# Altium schematic sheet TSevenSegmentDisplay.SchDoc: LiveDesign Evaluation - EvalBoard Tester
size A3; Organization: Altium Limited; Address1: L3, 12a Rodborough Rd; Address2: Frenchs Forest; Address3: NSW; Address4: Australia 2086; DocumentNumber: 14; SheetNumber: 14; SheetTotal: 16
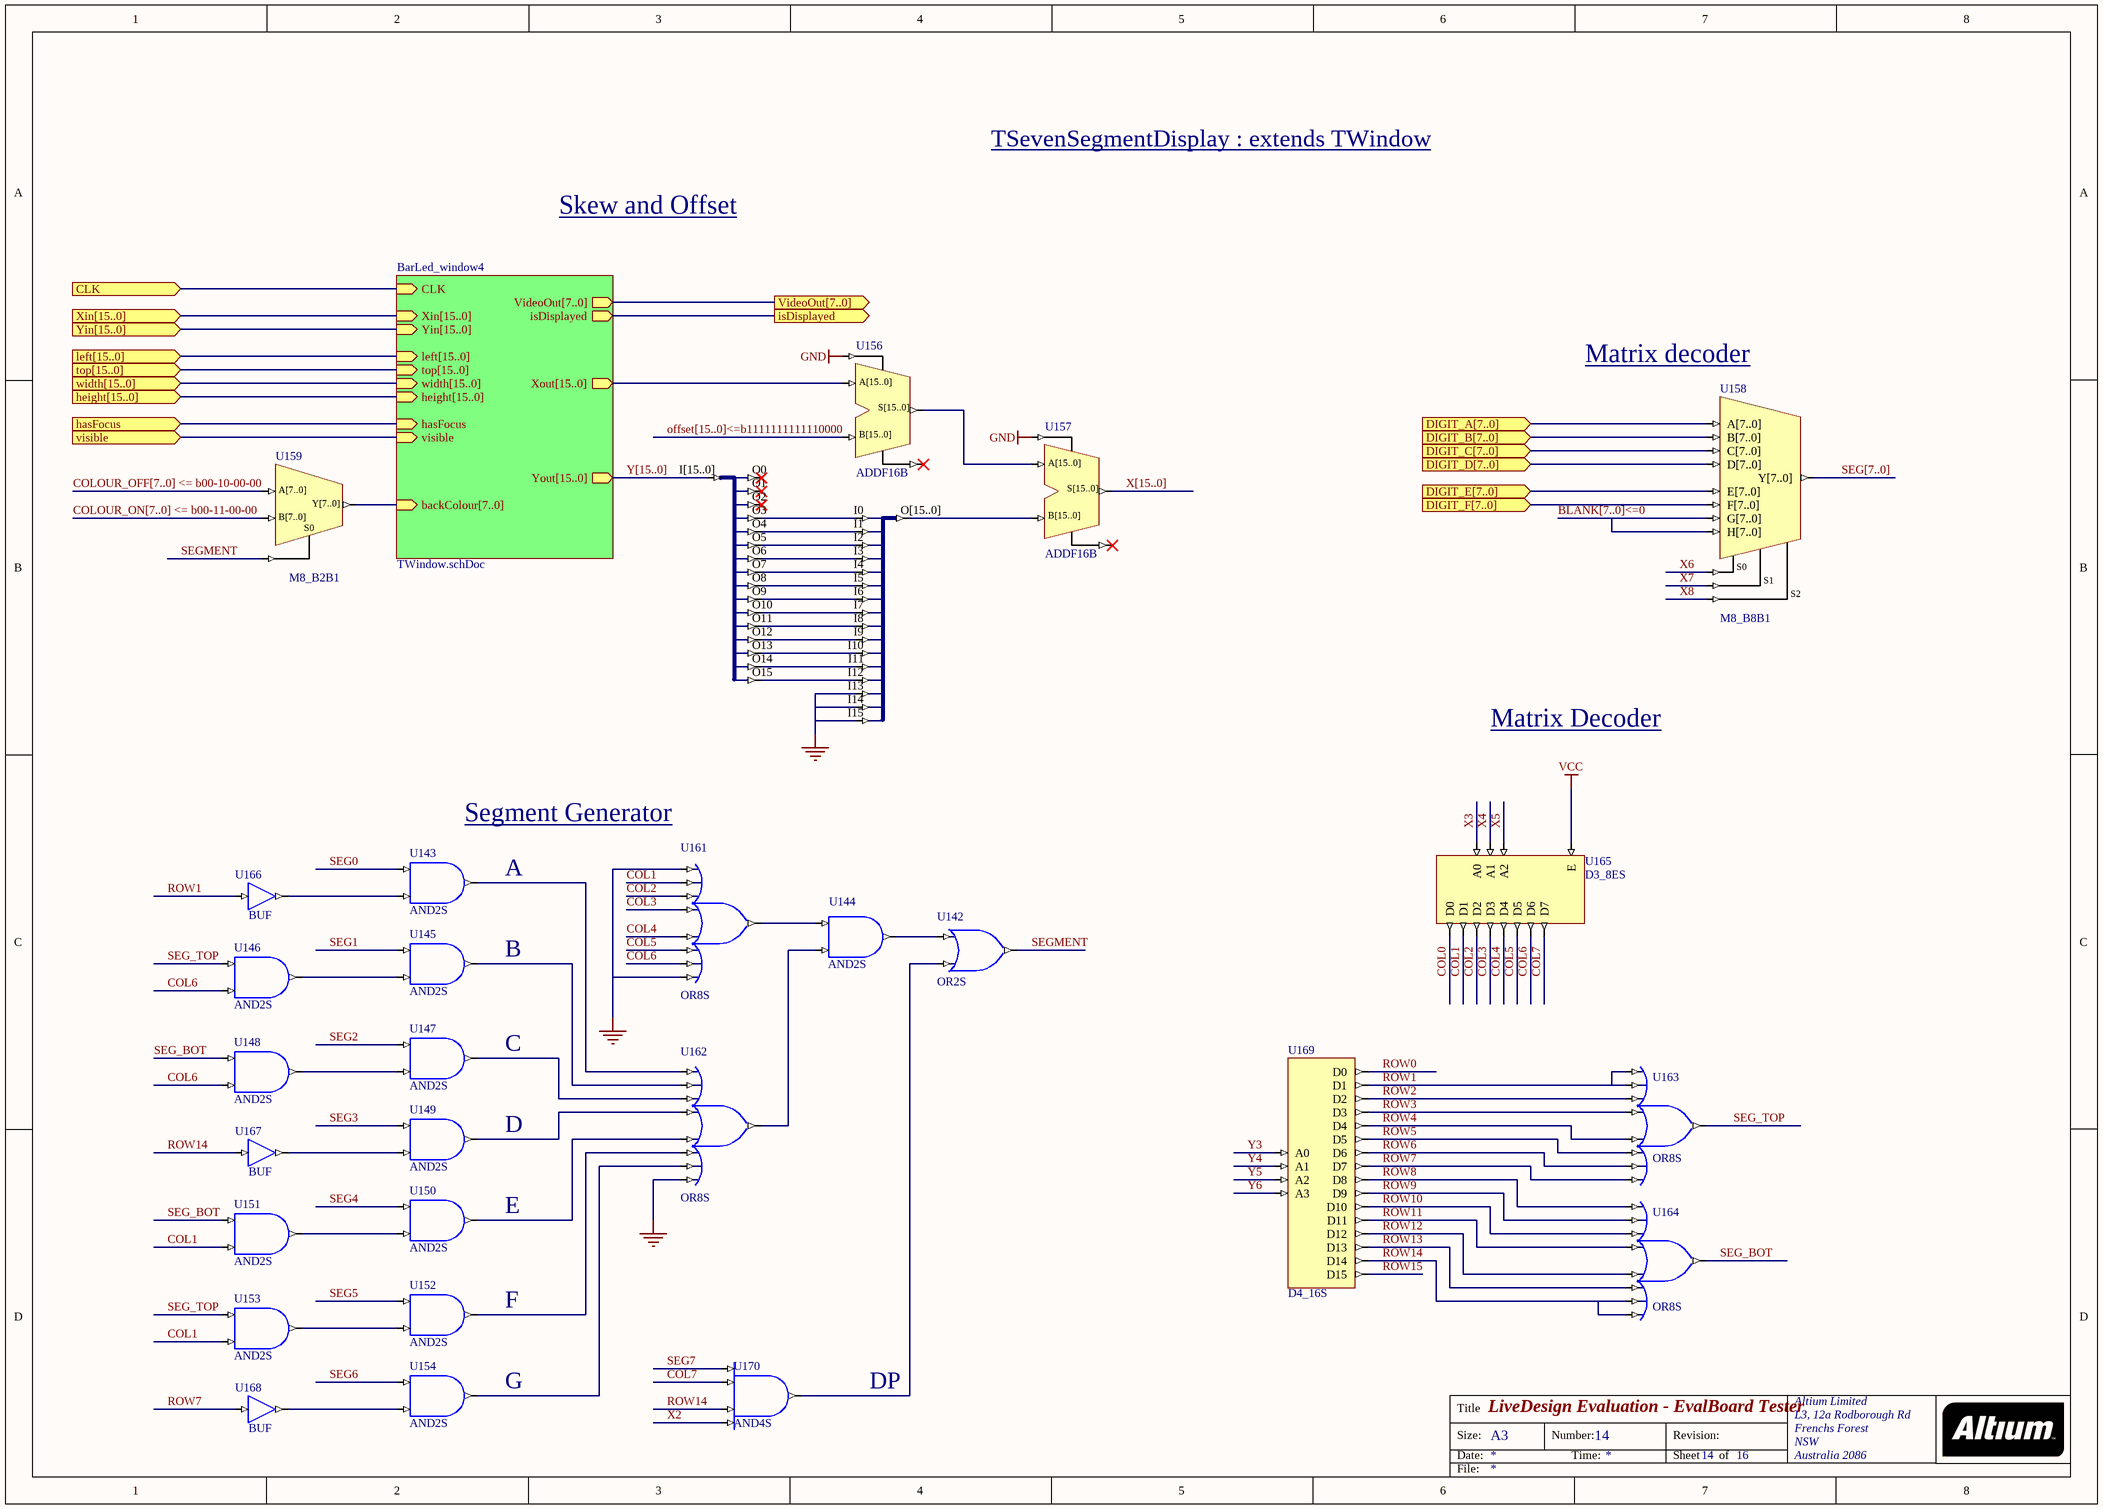
[diagram p0: TSevenSegmentDisplay.SchDoc]

## Parts
U142  OR2S
U143  AND2S
U144  AND2S
U145  AND2S
U146  AND2S
U147  AND2S
U148  AND2S
U149  AND2S
U150  AND2S
U151  AND2S
U152  AND2S
U153  AND2S
U154  AND2S
U155  J16B_16S  (value not drawn)
U156  ADDF16B
U157  ADDF16B
U158  M8_B8B1
U159  M8_B2B1
U160  J16S_16B  (value not drawn)
U161  OR8S
U162  OR8S
U163  OR8S
U164  OR8S
U165  D3_8ES
U166  BUF
U167  BUF
U168  BUF
U169  D4_16S
U170  AND4S

## Sub-sheets
BarLed_window4 = TWindow.schDoc: CLK (in), VideoOut[7..0] (out), Xin[15..0] (in), Yin[15..0] (in), top[15..0] (in), width[15..0] (in), height[15..0] (in), left[15..0] (in), Xout[15..0] (out), Yout[15..0] (out), backColour[7..0] (in), isDisplayed (out), visible (in), hasFocus (in)

## Ports
CLK (in), DIGIT_A[7..0] (in), DIGIT_B[7..0] (in), DIGIT_C[7..0] (in), DIGIT_D[7..0] (in), DIGIT_E[7..0] (in), DIGIT_F[7..0] (in), hasFocus (in), height[15..0] (in), isDisplayed (out), left[15..0] (in), top[15..0] (in), VideoOut[7..0] (out), visible (in), width[15..0] (in), Xin[15..0] (in), Yin[15..0] (in)

## Nets
GND: U156.CI U157.CI U160.I13 U160.I14 U160.I15 U161.I0 U161.I7 U162.I7
VCC: U165.E
BLANK[7..0]<=0: U158.G[7..0] U158.H[7..0]
CLK: port CLK, sheet BarLed_window4/CLK
COL0: U165.D0
COL1: U151.I1 U153.I1 U161.I1 U165.D1
COL2: U161.I2 U165.D2
COL3: U161.I3 U165.D3
COL4: U161.I4 U165.D4
COL5: U161.I5 U165.D5
COL6: U146.I1 U148.I1 U161.I6 U165.D6
COL7: U165.D7 U170.I1
COLOUR_OFF[7..0] <= b00-10-00-00: U159.A[7..0]
COLOUR_ON[7..0] <= b00-11-00-00: U159.B[7..0]
DIGIT_A[7..0]: U158.A[7..0] ; port DIGIT_A[7..0]
DIGIT_B[7..0]: U158.B[7..0] ; port DIGIT_B[7..0]
DIGIT_C[7..0]: U158.C[7..0] ; port DIGIT_C[7..0]
DIGIT_D[7..0]: U158.D[7..0] ; port DIGIT_D[7..0]
DIGIT_E[7..0]: U158.E[7..0] ; port DIGIT_E[7..0]
DIGIT_F[7..0]: U158.F[7..0] ; port DIGIT_F[7..0]
hasFocus: port hasFocus, sheet BarLed_window4/hasFocus
isDisplayed: port isDisplayed, sheet BarLed_window4/isDisplayed
offset[15..0]<=b1111111111110000: U156.B[15..0]
ROW0: U169.D0
ROW1: U163.I0 U163.I1 U166.I U169.D1
ROW2: U163.I2 U169.D2
ROW3: U163.I3 U169.D3
ROW4: U163.I4 U169.D4
ROW5: U163.I5 U169.D5
ROW6: U163.I6 U169.D6
ROW7: U163.I7 U168.I U169.D7
ROW8: U164.I0 U169.D8
ROW9: U164.I1 U169.D9
ROW10: U164.I2 U169.D10
ROW11: U164.I3 U169.D11
ROW12: U164.I4 U169.D12
ROW13: U164.I5 U169.D13
ROW14: U164.I6 U164.I7 U167.I U169.D14 U170.I2
ROW15: U169.D15
SEG0: U143.I0
SEG1: U145.I0
SEG2: U147.I0
SEG3: U149.I0
SEG4: U150.I0
SEG5: U152.I0
SEG6: U154.I0
SEG7: U170.I0
SEG[7..0]: U158.Y[7..0]
SEG_BOT: U148.I0 U151.I0 U164.O
SEG_TOP: U146.I0 U153.I0 U163.O
SEGMENT: U142.O U159.S0
visible: port visible, sheet BarLed_window4/visible
X2: U170.I3
X3: U165.A0
X4: U165.A1
X5: U165.A2
X6: U158.S0
X7: U158.S1
X8: U158.S2
X[15..0]: U157.S[15..0]
Y3: U169.A0
Y4: U169.A1
Y5: U169.A2
Y6: U169.A3
Y[15..0]: U155.I[15..0] ; sheet BarLed_window4/Yout[15..0]
NetU142_I0: U142.I0 U144.O
NetU142_I1: U142.I1 U170.O
NetU143_I1: U143.I1 U166.O
NetU143_O: U143.O U162.I0
NetU144_I0: U144.I0 U161.O
NetU144_I1: U144.I1 U162.O
NetU145_I1: U145.I1 U146.O
NetU145_O: U145.O U162.I1
NetU147_I1: U147.I1 U148.O
NetU147_O: U147.O U162.I2
NetU149_I1: U149.I1 U167.O
NetU149_O: U149.O U162.I3
NetU150_I1: U150.I1 U151.O
NetU150_O: U150.O U162.I4
NetU152_I1: U152.I1 U153.O
NetU152_O: U152.O U162.I5
NetU154_I1: U154.I1 U168.O
NetU154_O: U154.O U162.I6
NetU155_O3: U155.O3 U160.I0
NetU155_O4: U155.O4 U160.I1
NetU155_O5: U155.O5 U160.I2
NetU155_O6: U155.O6 U160.I3
NetU155_O7: U155.O7 U160.I4
NetU155_O8: U155.O8 U160.I5
NetU155_O9: U155.O9 U160.I6
NetU155_O10: U155.O10 U160.I7
NetU155_O11: U155.O11 U160.I8
NetU155_O12: U155.O12 U160.I9
NetU155_O13: U155.O13 U160.I10
NetU155_O14: U155.O14 U160.I11
NetU155_O15: U155.O15 U160.I12
NetU156_A[15..0]: U156.A[15..0] ; sheet BarLed_window4/Xout[15..0]
NetU156_S[15..0]: U156.S[15..0] U157.A[15..0]
NetU157_B[15..0]: U157.B[15..0] U160.O[15..0]
NetU159_Y[7..0]: U159.Y[7..0] ; sheet BarLed_window4/backColour[7..0]

Not connected (* = marked no-connect by the designer): U155 O0* O1* O2*; U156 CO*; U157 CO*

## Buses and harness runs
bus BLANK[7..0]<=0
bus COLOUR_OFF[7..0] <= b00-10-00-00
bus COLOUR_ON[7..0] <= b00-11-00-00
bus offset[15..0]<=b1111111111110000
bus port height[15..0] = sheet BarLed_window4/height[15..0]
bus port left[15..0] = sheet BarLed_window4/left[15..0]
bus port top[15..0] = sheet BarLed_window4/top[15..0]
bus port VideoOut[7..0] = sheet BarLed_window4/VideoOut[7..0]
bus port width[15..0] = sheet BarLed_window4/width[15..0]
bus port Xin[15..0] = sheet BarLed_window4/Xin[15..0]
bus port Yin[15..0] = sheet BarLed_window4/Yin[15..0]
bus SEG[7..0]
bus X[15..0]
bus Y[15..0] = sheet BarLed_window4/Yout[15..0]

## Notes on the sheet
- TSevenSegmentDisplay : extends TWindow
- Skew and Offset
- Matrix decoder
- Matrix Decoder
- Segment Generator
- (near U143) A
- B
- (near U147) C
- D
- E
- (near U152) F
- G
- DP
- Title
- Size:
- Date:
- A3
- Number:
- Time:
- Revision:
- Sheet
- of
- File:

## Library data of the parts
U142 = OR2S: 2-Input OR Gate, Single Pin Version; Xilinx Equivalent: OR2; ArchiveName: GENERIC; VHDLIB_SIM: GENERIC_LIB; Published: 29-Jan-2004; Publisher: Altium Limited; Core Revision: 1.00.00
U143-U154 = AND2S: 2-Input AND Gate, Single Pin Version; Xilinx Equivalent: AND2; ArchiveName: GENERIC; VHDLIB_SIM: GENERIC_LIB; Published: 29-Jan-2004; Publisher: Altium Limited; Core Revision: 1.00.00
U155 = J16B_16S: Single 16-Bit input bus to 16 single pin outputs; ArchiveName: GENERIC; VHDLIB_SIM: GENERIC_LIB; Published: 29-Jan-2004; Publisher: Altium Limited; Core Revision: 1.00.00
U156 U157 = ADDF16B: 16-Bit Cascadable Unsigned Binary Full Adder, Bus Version; ArchiveName: GENERIC; VHDLIB_SIM: GENERIC_LIB; Published: 31-May-2004; Publisher: Altium Limited; Core Revision: 1.00.00
U158 = M8_B8B1: 8x8-Bit Bus to 1x8-Bit Bus Multiplexer; ArchiveName: GENERIC; VHDLIB_SIM: GENERIC_LIB; Published: 29-Jan-2004; Publisher: Altium Limited; Core Revision: 1.00.00
U159 = M8_B2B1: 2x8-Bit Bus to 1x8-Bit Bus Multiplexer; ArchiveName: GENERIC; VHDLIB_SIM: GENERIC_LIB; Published: 29-Jan-2004; Publisher: Altium Limited; Core Revision: 1.00.00
U160 = J16S_16B: 16 Single pin inputs to single 16-Bit output bus; ArchiveName: GENERIC; VHDLIB_SIM: GENERIC_LIB; Published: 29-Jan-2004; Publisher: Altium Limited; Core Revision: 1.00.00
U161-U164 = OR8S: 8-Input OR Gate, Single Pin Version; Xilinx Equivalent: OR8; ArchiveName: GENERIC; VHDLIB_SIM: GENERIC_LIB; Published: 29-Jan-2004; Publisher: Altium Limited; Core Revision: 1.00.00
U165 = D3_8ES: Binary 3- to 8-Bit Decoder with Enable, Single Pin Version; Xilinx Equivalent: D3_8E; ArchiveName: GENERIC; VHDLIB_SIM: GENERIC_LIB; Published: 29-Jan-2004; Publisher: Altium Limited; Core Revision: 1.00.00
U166-U168 = BUF: 1-bit General Purpose (Non-inverting) Buffer; ArchiveName: GENERIC; VHDLIB_SIM: GENERIC_LIB; Published: 29-Jan-2004; Publisher: Altium Limited; Xilinx Equivalent: BUF; Core Revision: 1.00.00
U169 = D4_16S: Binary 4- to 16-Bit Decoder, Single Pin Version; ArchiveName: GENERIC; VHDLIB_SIM: GENERIC_LIB; Published: 29-Jan-2004; Publisher: Altium Limited; Core Revision: 1.00.00
U170 = AND4S: 4-Input AND Gate, Single Pin Version; Xilinx Equivalent: AND4; ArchiveName: GENERIC; VHDLIB_SIM: GENERIC_LIB; Published: 29-Jan-2004; Publisher: Altium Limited; Core Revision: 1.00.00